# EAGLE design shield_v5 (EAGLE 6.5.0)
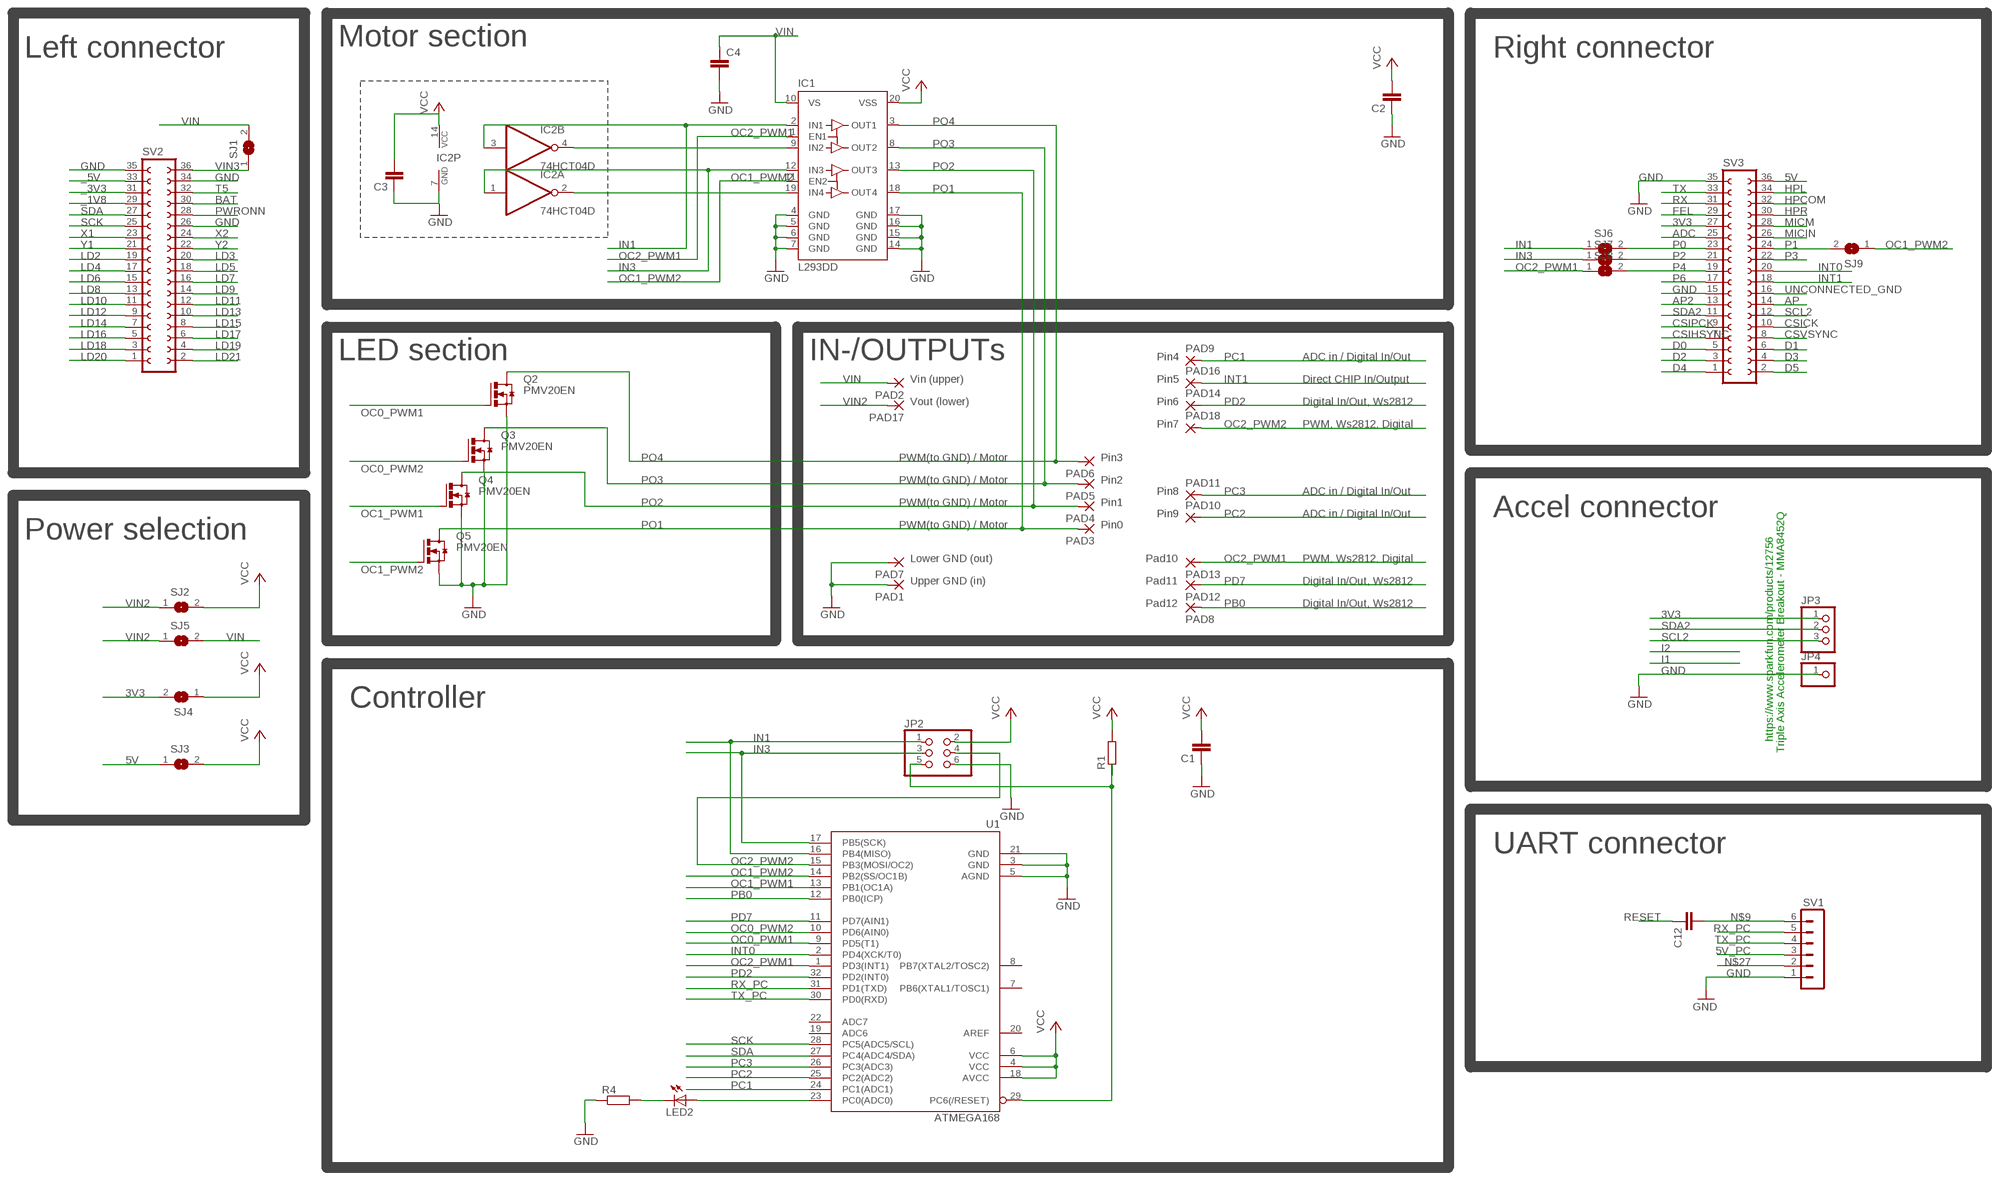
[diagram p0: schematic, sheet 1]

## Parts
C1  C-EUC0805  [C0805]
C2  C-EUC0805  [C0805]
C3  C-EUC0805  [C0805]
C4  C-EUC1210  [C1210]
C12  C-EUC1206  [C1206]
IC1  L293DD  [SO20]
IC2  74HCT04D  [SO14]
JP2  PINHD-2X3  [2X03]
JP3  PINHD-1X3  [1X03]
JP4  PINHD-1X1  [1X01]
LED2  LEDCHIP-LED0805  [CHIP-LED0805]
PAD1  3,17/1,3  [3,17/1,3]
PAD2  3,17/1,3  [3,17/1,3]
PAD3  3,17/1,3  [3,17/1,3]
PAD4  3,17/1,3  [3,17/1,3]
PAD5  3,17/1,3  [3,17/1,3]
PAD6  3,17/1,3  [3,17/1,3]
PAD7  3,17/1,3  [3,17/1,3]
PAD8  WIREPADSMD1,27-254  [SMD1,27-2,54]
PAD9  3,17/1,3  [3,17/1,3]
PAD10  3,17/1,3  [3,17/1,3]
PAD11  3,17/1,3  [3,17/1,3]
PAD12  SMD2  [SMD1,27-2,54]
PAD13  SMD2  [SMD1,27-2,54]
PAD14  3,17/1,3  [3,17/1,3]
PAD16  3,17/1,3  [3,17/1,3]
PAD17  3,17/1,3  [3,17/1,3]
PAD18  3,17/1,3  [3,17/1,3]
Q2  PMV20EN  NMOSFET_SMD_223  [SOT223]
Q3  PMV20EN  NMOSFET_SMD_223  [SOT223]
Q4  PMV20EN  NMOSFET_SMD_223  [SOT223]
Q5  PMV20EN  NMOSFET_SMD_223  [SOT223]
R1  R-EU_M1206  [M1206]
R4  R-EU_M1206  [M1206]
SJ1  SJ  [SJ]
SJ2  SJ  [SJ]
SJ3  SJ  [SJ]
SJ4  SJ  [SJ]
SJ5  SJ  [SJ]
SJ6  SJ  [SJ]
SJ7  SJ  [SJ]
SJ8  SJ  [SJ]
SJ9  SJ  [SJ]
SV1  MA06-1  [MA06-1]
SV2  FE18-2  [FE18-2]
SV3  FE18-2  [FE18-2]
U1  ATMEGA168  [TQFP32-08]

## Nets
3V3: JP3.1 SJ4.2 SV3.27
5V: SJ3.1 SV3.36
5V_PC: SV1.3
_1V8: SV2.29
_3V3: SV2.31
_5V: SV2.33
ADC: SV3.25
AP: SV3.14
AP2: SV3.13
BAT: SV2.30
CSICK: SV3.10
CSIHSYNC: SV3.7
CSIPCK: SV3.9
CSVSYNC: SV3.8
D0: SV3.5
D1: SV3.6
D2: SV3.3
D3: SV3.4
D4: SV3.1
D5: SV3.2
FEL: SV3.29
GND: C1.1 C2.1 C3.1 C4.2 IC1.4(GND) IC1.5(GND) IC1.6(GND) IC1.7(GND) IC1.14(GND) IC1.15(GND) IC1.16(GND) IC1.17(GND) IC2.7(P:GND) JP2.6 JP4.1 PAD1.1(P) PAD7.1(P) Q2.3(S) Q3.3(S) Q4.3(S) Q5.3(S) R4.1 SV1.1 SV2.26 SV2.34 SV2.35 SV3.15 SV3.35 U1.3(GND) U1.5(AGND) U1.21(GND)
HPCOM: SV3.32
HPL: SV3.34
HPR: SV3.30
IN1: IC1.2(IN1) IC2.3(B:I) JP2.1 SJ6.1 U1.16(PB4(MISO))
IN3: IC1.12(IN3) IC2.1(A:I) JP2.3 SJ7.1 U1.17(PB5(SCK))
INT0: SV3.20 U1.2(PD4(XCK/T0))
INT1: PAD16.1(P) SV3.18
LD2: SV2.19
LD3: SV2.20
LD4: SV2.17
LD5: SV2.18
LD6: SV2.15
LD7: SV2.16
LD8: SV2.13
LD9: SV2.14
LD10: SV2.11
LD11: SV2.12
LD12: SV2.9
LD13: SV2.10
LD14: SV2.7
LD15: SV2.8
LD16: SV2.5
LD17: SV2.6
LD18: SV2.3
LD19: SV2.4
LD20: SV2.1
LD21: SV2.2
MICIN: SV3.26
MICM: SV3.28
N$1: IC1.19(IN4) IC2.2(A:O)
N$9: C12.2 SV1.6
N$11: IC1.9(IN2) IC2.4(B:O)
N$23: LED2.C R4.2
N$26: LED2.A U1.23(PC0(ADC0))
N$27: SV1.2
OC0_PWM1: Q2.1(G) U1.9(PD5(T1))
OC0_PWM2: Q3.1(G) U1.10(PD6(AIN0))
OC1_PWM1: Q4.1(G) U1.13(PB1(OC1A))
OC1_PWM2: IC1.11(EN2) Q5.1(G) SJ9.1 U1.14(PB2(SS/OC1B))
OC2_PWM1: IC1.1(EN1) PAD13.1(P) SJ8.1 U1.1(PD3(INT1))
OC2_PWM2: JP2.4 PAD18.1(P) U1.15(PB3(MOSI/OC2))
P0: SJ6.2 SV3.23
P1: SJ9.2 SV3.24
P2: SJ7.2 SV3.21
P3: SV3.22
P4: SJ8.2 SV3.19
P6: SV3.17
PB0: PAD8.1(P) U1.12(PB0(ICP))
PC1: PAD9.1(P) U1.24(PC1(ADC1))
PC2: PAD10.1(P) U1.25(PC2(ADC2))
PC3: PAD11.1(P) U1.26(PC3(ADC3))
PD2: PAD14.1(P) U1.32(PD2(INT0))
PD7: PAD12.1(P) U1.11(PD7(AIN1))
PO1: IC1.18(OUT4) PAD3.1(P) Q5.2(D) Q5.4(D)
PO2: IC1.13(OUT3) PAD4.1(P) Q4.2(D) Q4.4(D)
PO3: IC1.8(OUT2) PAD5.1(P) Q3.2(D) Q3.4(D)
PO4: IC1.3(OUT1) PAD6.1(P) Q2.2(D) Q2.4(D)
PWRONN: SV2.28
RESET: C12.1 JP2.5 R1.1 U1.29(PC6(/RESET))
RX: SV3.31
RX_PC: SV1.5 U1.31(PD1(TXD))
SCK: SV2.25 U1.28(PC5(ADC5/SCL))
SCL2: JP3.3 SV3.12
SDA: SV2.27 U1.27(PC4(ADC4/SDA))
SDA2: JP3.2 SV3.11
T5: SV2.32
TX: SV3.33
TX_PC: SV1.4 U1.30(PD0(RXD))
UNCONNECTED_GND: SV3.16
VCC: C1.2 C2.2 C3.2 IC1.20(VSS) IC2.14(P:VCC) JP2.2 R1.2 SJ2.2 SJ3.2 SJ4.1 U1.4(VCC) U1.6(VCC) U1.18(AVCC)
VIN: C4.1 IC1.10(VS) PAD2.1(P) SJ1.2 SJ5.2
VIN2: PAD17.1(P) SJ2.1 SJ5.1
VIN3: SJ1.1 SV2.36
X1: SV2.23
X2: SV2.24
Y1: SV2.21
Y2: SV2.22
Unconnected: IC2.5(C:I) IC2.6(C:O) IC2.8(D:O) IC2.9(D:I) IC2.10(E:O) IC2.11(E:I) IC2.12(F:O) IC2.13(F:I) U1.7(PB6(XTAL1/TOSC1)) U1.8(PB7(XTAL2/TOSC2)) U1.19(ADC6) U1.20(AREF) U1.22(ADC7)

## Notes on the sheet
- Motor section
- Left connector | Right connector
- LED section | IN-/OUTPUTs | Pin4 | ADC in / Digital In/Out
- Vin (upper) | Pin5 | Direct CHIP In/Output
- Vout (lower) | Pin6 | Digital In/Out, Ws2812
- Pin7 | PWM, Ws2812, Digital
- PWM(to GND) / Motor | Pin3
- PWM(to GND) / Motor | Pin2
- Pin8 | ADC in / Digital In/Out
- PWM(to GND) / Motor | Pin1
- Pin9 | ADC in / Digital In/Out | Accel connector
- PWM(to GND) / Motor | Pin0
- Power selection
- Lower GND (out) | Pad10 | PWM, Ws2812, Digital
- Upper GND (in) | Pad11 | Digital In/Out, Ws2812
- Pad12 | Digital In/Out, Ws2812
- Controller
- https://www.sparkfun.com/products/12756
- Triple Axis Accelerometer Breakout - MMA8452Q
- UART connector

## Library data of the parts
C1-C4 C12 = rcl:C-EU: CAPACITOR, European symbol
IC1 = st-microelectronics:L293DD: PUSH-PULL FOUR CHANNEL DRIVER WITH DIODES Source: http://www.st.com/stonline/books/pdf/docs/1330.pdf; OC_FARNELL: unknown
IC2 = 74xx-eu:74*04: Hex INVERTER
JP2 = pinhead:PINHD-2X3: PIN HEADER
JP3 = adafruit:PINHD-1X3: PIN HEADER
JP4 = adafruit:PINHD-1X1: Pin header 1x1 for 0.1" spacing With round pins
LED2 = led:LED: LED OSRAM: - CHIPLED LG R971, LG N971, LY N971, LG Q971, LY Q971, LO R971, LY R971 LH N974, LH R974 LS Q976, LO Q976, LY Q976 LO Q996 - Hyper CHIPLED LW Q18S LB Q993, LB Q99A, LB R99A - SideLED LS A670, LO A670, LY A670, LG A670, LP A670 LB A673, LV A673, LT A673, LW A673 LH A674 LY A675 LS A676, LA A676, LO A676, LY A676, LW A676 LS A679, LY A679, LG A679 - Hyper Micro SIDELED® LS Y876, LA Y876, LO Y876, LY Y876 LT Y87S - SmartLED LW L88C, LW L88S LB L89C, LB L89S, LG L890 LS L89K, LO L89K, LY L89K LS L896, LA L896, LO L896, LY L896 - TOPLED LS T670, LO T670, LY T670, LG T670, LP T670 LSG T670, LSP T670, LSY T670, LOP T670, LYG T670 LG T671, LOG T671, LSG T671 LB T673, LV T673, LT T673, LW T673 LH T674 LS T676, LA T676, LO T676, LY T676, LB T676, LH T676, LSB T676, LW T676 LB T67C, LV T67C, LT T67C, LS T67K, LO T67K, LY T67K, LW E67C LS E67B, LA E67B, LO E67B, LY E67B, LB E67C, LV E67C, LT E67C LW T67C LS T679, LY T679, LG T679 LS T770, LO T770, LY T770, LG T770, LP T770 LB T773, LV T773, LT T773, LW T773 LH T774 LS E675, LA E675, LY E675, LS T675 LS T776, LA T776, LO T776, LY T776, LB T776 LHGB T686 LT T68C, LB T68C - Hyper Mini TOPLED® LB M676 - Mini TOPLED Santana® LG M470 LS M47K, LO M47K, LY M47K Source: http://www.osram.convergy.de LUXEON: - LUMILED® LXK2-PW12-R00, LXK2-PW12-S00, LXK2-PW14-U00, LXK2-PW14-V00 LXK2-PM12-R00, LXK2-PM12-S00, LXK2-PM14-U00 LXK2-PE12-Q00, LXK2-PE12-R00, LXK2-PE12-S00, LXK2-PE14-T00, LXK2-PE14-U00 LXK2-PB12-K00, LXK2-PB12-L00, LXK2-PB12-M00, LXK2-PB14-N00, LXK2-PB14-P00, LXK2-PB14-Q00 LXK2-PR12-L00, LXK2-PR12-M00, LXK2-PR14-Q00, LXK2-PR14-R00 LXK2-PD12-Q00, LXK2-PD12-R00, LXK2-PD12-S00 LXK2-PH12-R00, LXK2-PH12-S00 LXK2-PL12-P00, LXK2-PL12-Q00, LXK2-PL12-R00 Source: www.luxeon.com KINGBRIGHT: KA-3528ASYC Source: www.kingbright.com
PAD1-PAD7 PAD9-PAD11 PAD14 PAD16-PAD18 = wirepad:3,17/1,3: THROUGH-HOLE PAD
PAD8 = wirepad:WIREPAD: Wire PAD connect wire on PCB
PAD12 PAD13 = wirepad:SMD2: SMD PAD
Q2-Q5 = transistor-power:NMOSFET_SMD_223
R1 R4 = rcl:R-EU_: RESISTOR, European symbol
SJ1-SJ9 = jumper:SJ: SMD solder JUMPER
SV1 = con-lstb:MA06-1: PIN HEADER; OC_FARNELL: unknown; OC_NEWARK: unknown
SV2 SV3 = con-lsta:FE18-2: FEMALE HEADER; OC_FARNELL: unknown; OC_NEWARK: unknown
U1 = SparkFun-DigitalIC:ATMEGA168: Atmel 32-pin 8-bit micro, 16k flash.

## Board
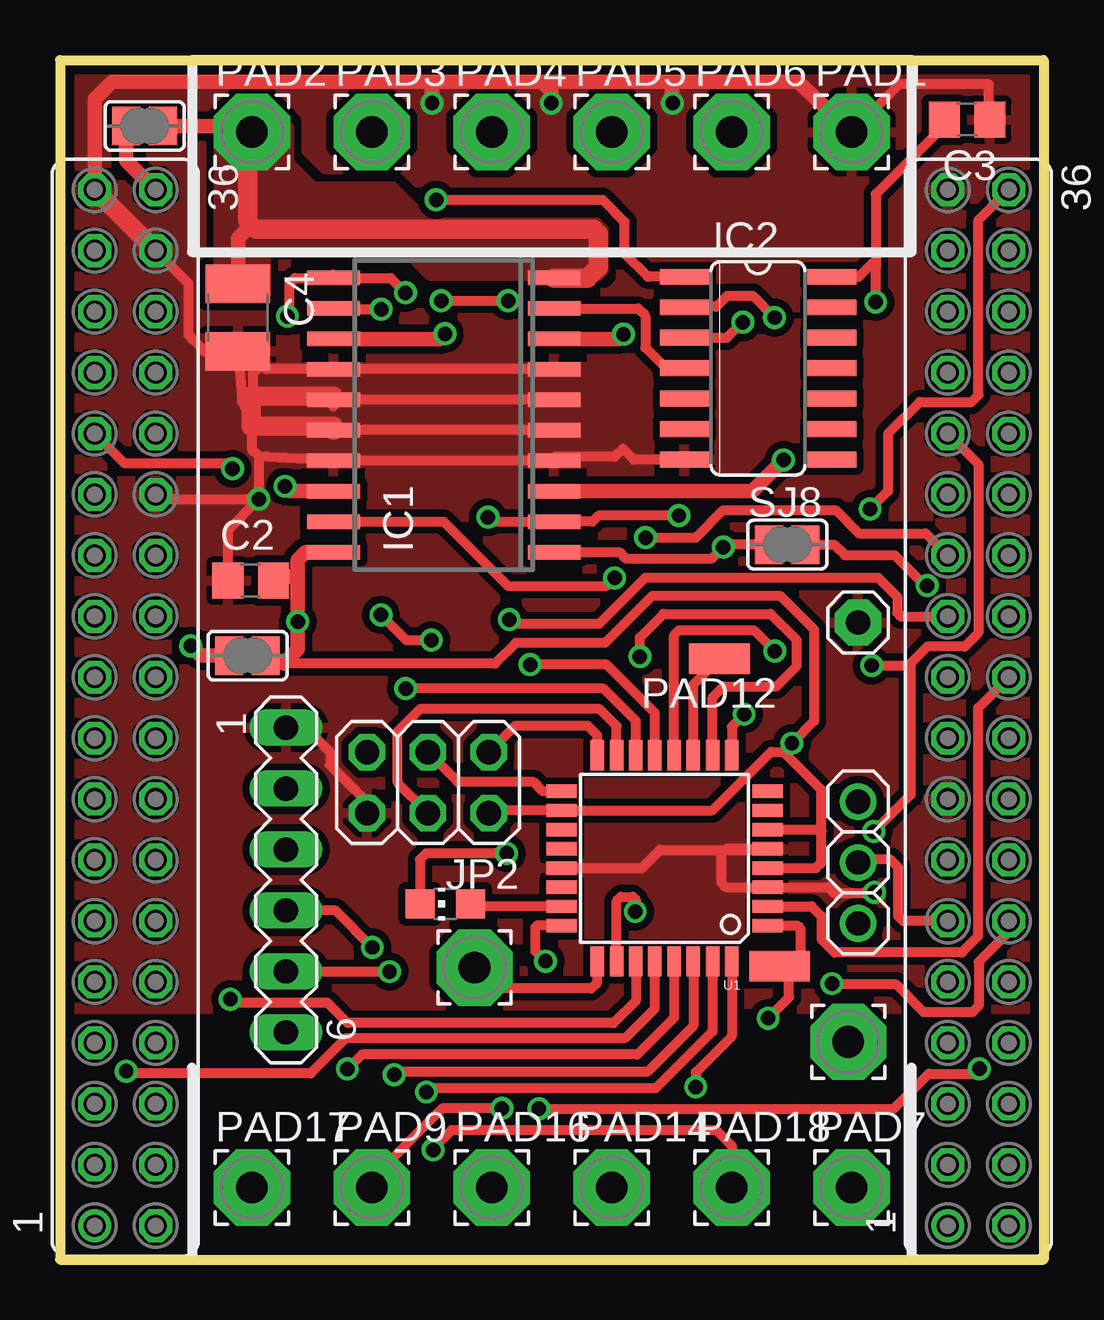
[diagram p1: board, top side]
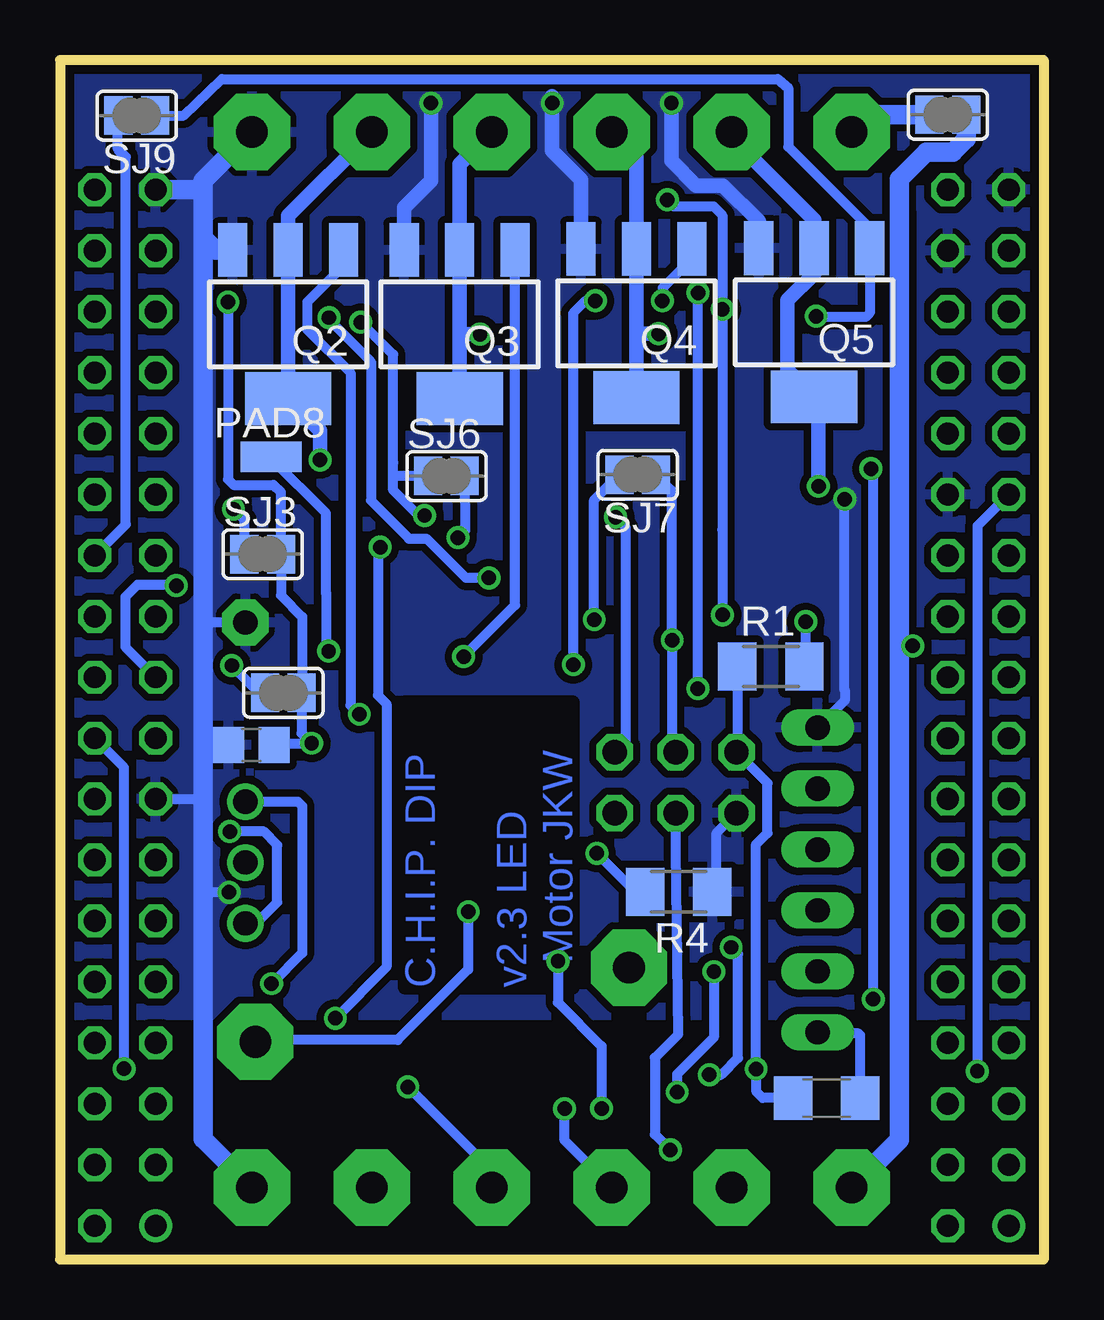
[diagram p2: board, bottom side, seen from below]

Size 41 x 50 mm. Coordinates in mm from the lower left corner, seen from the top.
Outline: 0,50 41,50 41,0 0,0 0,50
Copper layers (1*16): Top 0.0356mm / dielectric 1.5011mm / Bottom 0.0356mm
Design rules "oshpark": minimum track width 6mil, minimum drill 13mil, track to track 6mil, track to pad 6mil, pad to pad 6mil, via to via 6mil, smd to smd 6mil, copper to edge 15mil, drill to drill 6mil, minimum pad ring 7mil, minimum via ring 7mil, stop-mask expansion 3mil, vias tented up to drill 0mil, thermal gap 10mil

### Footprints (pad centres in the part's own frame; a part is rotated, then mirrored left to right if it is on the bottom)
C0805 = smd 1.3 x 1.5: 1 -0.95,0; 2 0.95,0
C1210 = smd 1.6 x 2.7: 1 -1.4,0; 2 1.4,0
C1206 = smd 1.6 x 1.8: 1 -1.4,0; 2 1.4,0
SO20 = smd 0.6 x 2.2: 1 -5.715,-4.6; 2 -4.445,-4.6; 3 -3.175,-4.6; 4 -1.905,-4.6; 5 -0.635,-4.6; 6 0.635,-4.6; 7 1.905,-4.6; 8 3.175,-4.6; 9 4.445,-4.6; 10 5.715,-4.6; 11 5.715,4.6; 12 4.445,4.6; 13 3.175,4.6; 14 1.905,4.6; 15 0.635,4.6; 16 -0.635,4.6; 17 -1.905,4.6; 18 -3.175,4.6; 19 -4.445,4.6; 20 -5.715,4.6
SO14 = smd 0.66 x 2.032: 1 -3.81,-3.073; 2 -2.54,-3.073; 3 -1.27,-3.073; 4 0,-3.073; 5 1.27,-3.073; 6 2.54,-3.073; 7 3.81,-3.073; 8 3.81,3.073; 9 2.54,3.073; 10 1.27,3.073; 11 0,3.073; 12 -1.27,3.073; 13 -2.54,3.073; 14 -3.81,3.073
2X03 = drill 1.016 octagon: 1 -2.54,-1.27; 2 -2.54,1.27; 3 0,-1.27; 4 0,1.27; 5 2.54,-1.27; 6 2.54,1.27
1X03 = drill 1.016: 1 -2.54,0; 2 0,0; 3 2.54,0
1X01 = drill 1.016 pad 1.93 octagon: 1 0,0
CHIP-LED0805 = smd 1.2 x 1.2: A 0,-1.05; C 0,1.05
3,17/1,3 = drill 1.321 pad 3.175 octagon: 1 0,0
SMD1,27-2,54 = smd 1.27 x 2.54: 1 0,0
SOT223 = smd 1.219 x 2.235: 1 -2.311,-3.099; 2 0,-3.099; 3 2.311,-3.099 | smd 3.6 x 2.2: 4 0,3.099
M1206 = smd 1.6 x 2: 1 -1.4,0; 2 1.4,0
SJ = smd 1.168 x 1.6: 1 -0.762,0; 2 0.762,0
MA06-1 = drill 1.016 long: 1 -6.35,0; 2 -3.81,0; 3 -1.27,0; 4 1.27,0; 5 3.81,0; 6 6.35,0
FE18-2 = drill 0.914: 1 -21.59,1.27 | drill 0.914 octagon: 2 -21.59,-1.27; 3 -19.05,1.27; 4 -19.05,-1.27; 5 -16.51,1.27; 6 -16.51,-1.27; 7 -13.97,1.27; 8 -13.97,-1.27; 9 -11.43,1.27; 10 -11.43,-1.27; 11 -8.89,1.27; 12 -8.89,-1.27; 13 -6.35,1.27; 14 -6.35,-1.27; 15 -3.81,1.27; 16 -3.81,-1.27; 17 -1.27,1.27; 18 -1.27,-1.27; 19 1.27,1.27; 20 1.27,-1.27; 21 3.81,1.27; 22 3.81,-1.27; 23 6.35,1.27; 24 6.35,-1.27; 25 8.89,1.27; 26 8.89,-1.27; 27 11.43,1.27; 28 11.43,-1.27; 29 13.97,1.27; 30 13.97,-1.27; 31 16.51,1.27; 32 16.51,-1.27; 33 19.05,1.27; 34 19.05,-1.27; 35 21.59,1.27; 36 21.59,-1.27
TQFP32-08 = smd 1.27 x 0.559: 1 -4.293,2.8; 2 -4.293,2; 3 -4.293,1.2; 4 -4.293,0.4; 5 -4.293,-0.4; 6 -4.293,-1.2; 7 -4.293,-2; 8 -4.293,-2.8; 17 4.293,-2.8; 18 4.293,-2; 19 4.293,-1.2; 20 4.293,-0.4; 21 4.293,0.4; 22 4.293,1.2; 23 4.293,2; 24 4.293,2.8 | smd 0.559 x 1.27: 9 -2.8,-4.293; 10 -2,-4.293; 11 -1.2,-4.293; 12 -0.4,-4.293; 13 0.4,-4.293; 14 1.2,-4.293; 15 2,-4.293; 16 2.8,-4.293; 25 2.8,4.293; 26 2,4.293; 27 1.2,4.293; 28 0.4,4.293; 29 -0.4,4.293; 30 -1.2,4.293; 31 -2,4.293; 32 -2.8,4.293

### Placement (x,y rotation side)
C1  33.02,21.45 0 bottom
C2  7.95,28.3 0 top
C3  37.81,47.52 180 top
C4  7.42,39.26 270 top
C12  9.04,6.73 0 bottom
IC1  16,35.2 90 top
IC2  29.1,37.15 270 top
JP2  15.34,19.88 180 top
JP3  33.27,16.55 90 top
JP4  33.27,26.55 0 top
LED2  16.06,14.82 90 top
PAD1  33,47 0 top
PAD2  8,47 0 top
PAD3  13,47 0 top
PAD4  18,47 0 top
PAD5  23,47 0 top
PAD6  28,47 0 top
PAD7  33,3 0 top
PAD8  32.19,33.45 270 bottom
PAD9  13,3 0 top
PAD10  17.28,12.17 0 top
PAD11  32.86,9.07 0 top
PAD12  27.49,25.05 90 top
PAD13  30,12.23 90 top
PAD14  23,3 0 top
PAD16  18,3 0 top
PAD17  8,3 0 top
PAD18  28,3 0 top
Q2  31.49,38.98 180 bottom
Q3  24.34,38.98 180 bottom
Q4  16.97,39.02 180 bottom
Q5  9.56,39.06 180 bottom
R1  11.37,24.72 0 bottom
R4  15.21,15.33 180 bottom
SJ1  3.53,47.25 0 top
SJ2  7.82,25.17 0 top
SJ3  32.55,29.4 0 bottom
SJ4  31.69,23.62 180 bottom
SJ5  3.99,47.72 180 bottom
SJ6  24.89,32.66 0 bottom
SJ7  16.92,32.71 180 bottom
SJ8  30.32,29.8 0 top
SJ9  37.8,47.68 180 bottom
SV1  9.42,15.82 270 top
SV2  2.72,23 90 top
SV3  38.28,23 90 top
U1  25.2,16.72 180 top

### Tracks (layer width: path | path; a pad name or v marks a point on that pad's centre or on a via)
3V3  (via drill 0.6)
  Top 0.406: 35.46,24.86 35.46,19.37 35.45,19.37 v33.92,17.84 | SV3.27 38.28,33.16 38.28,26.12 37.71,25.55 36.15,25.55 35.46,24.86 | v33.84,24.76 35.36,24.76 35.46,24.86
  Bottom 0.406: JP3.1 32.82,14.01 31.94,14.89 31.94,17.28 32.5,17.84 v33.92,17.84 | v33.84,24.76 32.7,23.62 SJ4.2
5V  (via drill 0.6)
  Top 0.406: v33.77,31.28 34.52,32.03 34.52,34.42 35.84,35.74 37.99,35.74 38.29,36.04 38.29,43.33 SV3.36
  Bottom 0.406: SJ3.1 33.31,30.82 v33.77,31.28
GND  (via drill 0.6)
  Top 0.152: 11.43,34.29 11.4,34.74 | 11.43,35.56 11.4,35.56
  Top 0.406: 8.34,33.48 IC1.17 IC1.4 20.61,33.46 23.12,33.46 23.46,33.8 23.92,33.34 IC2.7 | 8.34,33.48 8.3,33.48 | 8.3,33.48 8.01,33.77 8.01,34.69 | 8.01,34.69 7.96,34.74 | 7.96,36 8.04,36.08 8.04,36.91 8.41,37.28 8.6,37.1 IC1.14 IC1.7 | 7.96,35.38 7.59,35.75 C4.2 6.03,37.86 5.51,38.38 5.51,38.4 5.36,38.55 5.36,40.68 SV2.34 | 8.01,34.69 8.01,35.23 7.7,35.54 | 8.3,33.44 8.3,32.5 8.29,32.49 v8.29,31.69 | 8.3,33.44 8.3,33.48 | U1.21 24.25,16.32 25.01,17.08 29.45,17.08 U1.5 27.79,17.12 27.56,16.89 27.56,15.73 27.77,15.52 U1.3 32.01,15.52 32.25,15.28 33.92,15.28 v33.95,15.31 | 8.3,33.44 8.34,33.48 | v8.29,31.69 v8.28,31.69 | IC1.6 IC1.15 11.4,35.56 | IC1.5 IC1.16 | C3.1 38.72,47.56 38.72,48.98 34.98,48.98 PAD1.1 | SV1.1 10.24,22.17 11.26,21.15 11.26,20.62 12.8,19.08 JP2.6 | SV2.26 4.19,31.69 v8.29,31.69 | C2.1 7,30.4 v8.29,31.69 | 11.4,34.74 IC1.16 | IC1.16 | 11.4,35.56
  Top 0.61: 15.51,49.1 2.18,49.1 1.45,48.37 SV2.35 | 15.51,49.1 20.08,49.1 | 20.08,49.1 25.51,49.1 | 25.51,49.1 30.77,49.1 PAD1.1 | v25.54,48.2 25.51,48.52 25.51,49.1 | v15.51,48.2 15.51,49.1 | v20.48,48.2 20.48,48.7 20.08,49.1
  Top 0.813: SV2.35 SV2.34 | IC1.15 11.38,36 7.96,36 7.96,35.38 7.96,34.74 11.39,34.74 IC1.16
  Bottom 0.406: SV3.15 35.11,19.19 35.04,19.12 | C1.1 34.87,21.33 | SV1.1 8.29,23.3 8.29,23.73 8.3,23.74 v8.3,31.68 v8.29,31.69 | 35.05,15.41 35.04,15.42 | v33.95,15.31 34.93,15.31 35.04,15.2 | C1.1 35,21.45 35.04,21.41 | C1.1 34.9,21.45 34.92,21.43 | JP4.1 34.89,26.55 35.04,26.4 | R4.1 13.63,15.51 13.63,17.78 JP2.6
  Bottom 0.61: Q3.3 26.65,43.85 25.54,44.96 v25.54,48.2 | Q4.3 19.28,45.01 20.49,46.22 20.49,48.48 v20.48,48.2 | Q5.3 11.87,43.28 13.36,44.77 14.48,44.77 15.51,45.8 v15.51,48.2
  Bottom 0.813: PAD1.1 35.04,44.96 35.04,44.55 | 35.04,44.55 35.04,42.6 | 35.04,42.6 35.04,26.4 35.04,21.41 35.04,19.12 35.04,15.42 35.04,15.2 35.04,5.04 PAD7.1 | SV3.35 35.08,44.59 35.04,44.55 | Q2.3 34.52,42.08 35.04,42.6
  pour Top (no thermals): 7.53,37.21 22.33,37.21 23.52,37.14 23.83,37.08 24.34,36.68 24.34,33.78 24.08,33.18 8.49,33.18 7.45,34.41 5.84,34.41 5.59,34.66 5.68,38.46 6.07,38.38 7.13,38.41 7.18,38.33 8.28,38.23
  pour Top (isolate 0.305, rank 2): -0.07,10.44 40.88,10.44 41.01,10.57 41.01,50.01 38.31,50.01 0,50.01 0,10.47
  pour Bottom (isolate 0.305): 0,50 41.05,50 41.05,10.19 0.02,10.19 0.02,49.92
IN1  (via drill 0.6)
  Top 0.406: U1.16 22.4,21.85 22.01,22.24 18.97,22.24 JP2.1 | v28.46,39.07 27.81,38.42 IC2.3 | v17.84,30.94 18.02,30.75 IC1.2 22.2,30.75 22.45,31.01 v25.8,31.01
  Bottom 0.406: 27.11,32.66 27.11,33.2 27.11,37.72 v28.46,39.07 | SJ6.1 27.11,32.66 | JP2.1 17.41,21.62 17.41,30.51 v17.84,30.94 | v25.8,31.01 26.05,31.01 27.11,32.07 27.11,32.66
IN3  (via drill 0.6)
  Top 0.406: U1.17 20.12,19.52 19.74,19.9 16.59,19.9 JP2.3 | v15.68,44.17 22.62,44.17 23.54,43.25 23.54,41.92 24.5,40.96 IC2.1 | v13.39,39.61 11.44,39.61 IC1.12 | v13.38,26.87 14.43,25.82 v15.48,25.82
  Bottom 0.406: v15.68,44.17 15.41,43.9 13.76,43.9 13.39,43.53 v13.39,39.61 13.39,30.41 13.38,29.72 v13.38,26.87 | JP2.3 15.48,21.29 v15.48,25.82 15.48,32.03 SJ7.1
INT0
  Top 0.406: SV3.20 38.28,23 38.28,13.48 37.6,12.8 32.29,12.8 31.74,13.35 31.74,14.31 31.33,14.72 U1.2
INT1  (via drill 0.6)
  Top 0.406: v19.96,6.29 34.76,6.29 36.22,7.75 38.13,7.75 v38.33,7.95
  Bottom 0.406: PAD16.1 19.96,4.96 v19.96,6.29 | v38.33,7.95 38.33,20.51 SV3.18
N$1  (via drill 0.6)
  Top 0.406: IC2.2 26.05,39.71 27.36,39.71 27.82,40.17 28.88,40.17 v29.79,39.26 | IC1.19 15.99,30.75 18.67,28.08 22.79,28.08 v23.12,28.41
  Bottom 0.406: v23.12,28.41 24.08,28.41 25.72,30.05 26.45,30.05 28.04,31.64 28.04,37.42 29.79,39.17 v29.79,39.26
N$9
  Bottom 0.406: C12.2 7.64,9.35 7.71,9.42 9.37,9.42 SV1.6
N$11
  Top 0.406: IC2.4 25.26,37.15 24.4,38.01 24.4,39.34 24.09,39.65 IC1.9
N$23  (via drill 0.6)
  Top 0.406: v18.62,16.93 15.27,16.93 15.01,16.67 LED2.C
  Bottom 0.406: R4.2 17.02,15.33 v18.62,16.93
N$26
  Top 0.406: U1.23 17.21,14.72 LED2.A
OC0_PWM1  (via drill 0.6)
  Top 0.406: v28.52,22.73 28,22.21 U1.9
  Bottom 0.406: v28.52,22.73 28.89,23.1 28.89,36.96 30.69,38.76 30.69,39.91 29.18,41.42 Q2.1
OC0_PWM2  (via drill 0.6)
  Top 0.406: U1.10 27.2,23.43 27.66,23.89 29.86,23.89 30.71,24.74 30.71,25.82 29.62,26.91 25.15,26.91 24.17,25.93 v24.17,25.13
  Bottom 0.406: v24.17,25.13 22.03,27.27 Q3.1 22.06,42.05
OC1_PWM1  (via drill 0.6)
  Top 0.406: v15.89,39.96 v18.68,39.96 | U1.13 24.8,22.79 22.79,24.8 v19.6,24.8
  Bottom 0.406: v15.89,39.96 15.87,39.98 15.87,40.51 14.66,41.72 Q4.1 | v18.68,39.96 19.09,39.96 19.61,39.44 19.6,39.43 v19.6,24.8
OC1_PWM2  (via drill 0.6)
  Top 0.406: 11.37,41.06 IC1.11 | v9.48,39.32 9.58,39.42 9.58,40.7 9.79,40.91 IC1.11 | IC1.11 13.79,40.91 v14.4,40.3 | U1.14 24,22.45 22.65,23.8 v14.41,23.8
  Bottom 0.406: v14.41,23.8 v14.41,40.29 v14.4,40.3 | v9.48,39.32 9.45,39.29 7.41,39.29 7.25,39.45 Q5.1 7.25,42.2 7.25,42.99 10.64,46.38 10.64,48.83 11.08,49.2 34.26,49.2 35.85,47.68 SJ9.1
OC2_PWM1  (via drill 0.6)
  Top 0.406: U1.1 30.73,13.92 30.87,13.78 30.87,12.71 30.39,12.23 PAD13.1 30.39,11.84 30.39,10.93 v29.52,10.06 | IC1.1 23.32,29.48 23.58,29.22 27.18,29.22 v27.65,29.69 27.76,29.8 SJ8.1
  Bottom 0.406: v29.52,10.06 27.39,12.19 27.39,23.16 27.75,23.52 27.75,29.59 v27.65,29.69
OC2_PWM2  (via drill 0.6)
  Top 0.406: v15.56,4.57 15.56,4.63 16.32,5.39 27.36,5.39 28,4.75 PAD18.1 | JP2.4 14.08,19.87 14.08,22.02 15,22.94 22.49,22.94 23.2,22.23 U1.15
  Bottom 0.406: JP2.4 15.22,9.39 16.2,8.41 16.2,5.21 v15.56,4.57
P0  (via drill 0.6)
  Top 0.406: 36.98,29.38 SV3.23 36.09,30.27 33.3,30.27 32.34,31.23 27.64,31.23 26.5,30.09 v24.41,30.09
  Bottom 0.406: SJ6.2 24.11,30.39 v24.41,30.09
P1
  Bottom 0.406: SV3.24 38.26,30.64 38.26,45.96 38.59,46.29 38.59,47.65 SJ9.2
P2  (via drill 0.6)
  Top 0.406: SV3.21 35.06,26.8 34.9,26.96 34.9,27.62 34.11,28.41 24.39,28.41 22.47,26.49 18.91,26.49 v18.73,26.67
  Bottom 0.406: SJ7.2 18.73,31.66 v18.73,26.67
P4  (via drill 0.6)
  Top 0.406: SJ8.2 32.27,29.8 32.71,29.36 34.79,29.36 36.06,28.09 v36.15,28.09
  Bottom 0.406: SV3.19 38.28,25.54 38.28,27.62 37.77,28.13 36.08,28.13 v36.15,28.09
PB0  (via drill 0.6)
  Top 0.406: U1.12 25.6,26.03 25.78,26.21 28.95,26.21 v29.8,25.36
  Bottom 0.406: 29.91,27.77 29.91,25.47 v29.8,25.36 | 29.9,27.78 29.91,27.77 | 29.91,27.77 29.91,31.11 32.19,33.39 PAD8.1
PC1  (via drill 0.6)
  Top 0.406: v18.42,6.3 15.93,6.3 13,3.37 PAD9.1 | U1.24 19.88,13.92 19.81,13.85 19.81,12.86 v20.24,12.43
  Bottom 0.406: 18.47,6.35 v18.42,6.3 18.42,8.89 20.24,10.71 v20.24,12.43
PC2
  Top 0.406: PAD10.1 18.15,11.3 22.14,11.3 22.4,11.56 U1.25
PC3  (via drill 0.6)
  Top 0.406: v23.98,14.5 24,14.52 24,14.99 23.87,15.12 23.38,15.12 23.2,14.94 U1.26
  Bottom 0.406: v23.98,14.5 23.98,12.09 26.92,9.15 32.78,9.15 PAD11.1
PD2  (via drill 0.6)
  Top 0.406: U1.32 28,9.31 26.5,7.81 v26.5,7.19
  Bottom 0.406: v26.5,7.19 23,3.69 PAD14.1
PD7
  Top 0.406: U1.11 26.4,23.96 PAD12.1
PO1  (via drill 0.6)
  Top 0.406: 9.4,32.2 v9.38,32.23
  Top 0.61: IC1.18 9.59,32.02 v9.38,32.23
  Bottom 0.406: 9.38,35.78 Q5.4
  Bottom 0.61: PAD3.1 13,46.77 9.56,43.33 Q5.2 9.56,41.1 10.68,39.98 10.68,37.08 Q5.4 | v9.38,32.23 9.38,35.78
PO2  (via drill 0.6)
  Top 0.406: 16.02,38.55 v16.05,38.59
  Top 0.61: IC1.13 15.84,38.38 v16.05,38.59
  Bottom 0.61: Q4.4 16.97,38.59 | 16.97,38.59 Q4.2 16.97,45.97 PAD4.1 | v16.05,38.59 16.97,38.59
PO3  (via drill 0.6)
  Top 0.406: 23.48,38.55 v23.49,38.57
  Top 0.61: IC1.8 23.3,38.38 v23.49,38.57
  Bottom 0.406: 24.32,38.57 24.34,38.55
  Bottom 0.61: PAD5.1 24.34,45.66 Q3.2 24.34,38.55 Q3.4 | v23.49,38.57 24.32,38.57
PO4  (via drill 0.6)
  Top 0.61: v30.16,33.33 28.86,32.02 IC1.3
  Bottom 0.61: PAD6.1 31.49,43.51 Q2.2 Q2.4 30.16,34.55 v30.16,33.33
RESET  (via drill 0.6)
  Top 0.406: U1.29 25.6,10.08 24.07,8.55 12.59,8.55 v11.98,7.94
  Bottom 0.406: C12.1 11.71,6.73 11.96,6.98 11.96,7.92 v11.98,7.94 11.98,17.31 11.51,17.78 11.51,19.86 JP2.5 | 13,21.35 JP2.5 | R1.1 12.77,21.18 JP2.5
RX_PC  (via drill 0.6)
  Top 0.406: U1.31 27.2,9.51 24.83,7.14 15.44,7.14 v15.28,6.98 v15.27,6.98 | v13.74,12 SV1.5
  Bottom 0.406: v15.27,6.98 15.27,7.73 13.74,9.26 v13.74,12
SCK  (via drill 0.6)
  Top 0.406: U1.28 24.8,10.47 23.55,9.22 11.91,9.22 10.45,7.76 2.85,7.76 v2.76,7.85
  Bottom 0.406: SV2.25 2.76,30.58 v2.76,7.85
SCL2  (via drill 0.6)
  Top 0.406: SV3.12 39.55,13.65 38.3,12.4 38.3,10.57 38.04,10.31 36.01,10.31 34.86,11.46 32.22,11.46 v32.18,11.5
  Bottom 0.406: 31.86,11.82 v32.18,11.5 30.9,12.78 30.9,18.9 31.09,19.09 JP3.3
SDA  (via drill 0.6)
  Top 0.406: SV2.27 2.7,33.18 6.97,33.18 v7.19,32.96 | U1.27 24,10.78 23.08,9.86 11.99,9.86 11.15,10.7 7.25,10.7 v7.1,10.85 7.21,10.74
  Bottom 0.406: v7.1,10.85 7.1,32.87 v7.19,32.96
SDA2
  Top 0.406: SV3.11 35.14,14.11 34.94,14.31 34.94,16.34 34.61,16.67 33.39,16.67 JP3.2
TX_PC  (via drill 0.6)
  Top 0.406: 9.47,14.6 SV1.4 11.48,14.55 v13.02,13.01 | U1.30 26.4,9.75 24.48,7.83 14.06,7.83 v13.93,7.7
  Bottom 0.406: v13.93,7.7 13.43,7.7 12.73,8.4 12.73,12.72 v13.02,13.01
VCC  (via drill 0.6)
  Top 0.406: 31.12,17.92 U1.6 31.68,17.92 31.74,17.86 | v34,39.91 34,41.32 | U1.4 31.52,16.32 31.74,16.54 31.74,17.86 | 31.74,17.86 31.74,19.57 30.15,21.16 | 34,41.32 33.83,41.49 33.3,40.96 IC2.14 | 36.86,47.33 C3.2 36.86,47.27 34,44.41 34,41.32 | JP2.2 17.99,18.72 U1.18 27.2,18.72 29.64,21.16 30.15,21.16 | SJ2.2 8.91,24.84 9.32,24.84 18.14,24.84 19,25.7 22.72,25.7 24.67,27.65 30.04,27.65 31.43,26.26 31.43,22.44 v30.51,21.52 30.15,21.16
  Top 0.61: 9.32,24.84 9.91,25.43 v9.91,26.59 9.91,28.46 | IC1.20 10.23,29.48 9.91,29.16 9.91,28.46 | C2.2 9.06,28.46 9.91,28.46
  Bottom 0.406: 32.31,21.16 C1.2 | C1.2 31.94,21.4 31.82,21.52 v30.51,21.52 30.93,21.94 SJ4.1 30.9,23.65 30.9,26.79 31.79,27.68 SJ3.2 31.8,29.41 31.8,31.98 32.11,32.29 33.77,32.29 34,32.52 v34,39.91 | 31.74,21.12 C1.2 | R1.2 9.91,24.78 v9.91,26.59
VIN
  Top 0.406: 22.44,42.75 22.24,42.95 | 8.2,42.95 8,43.16 7.83,43.32 | SJ1.2 4.22,47.25
  Top 0.61: C4.1 7.42,42.58 8,43.16 | SJ1.2 7.75,47.25
  Top 0.813: 22.44,42.75 22.44,41.37 21.98,40.91 IC1.10 | 22.24,42.95 8.2,42.95 | 7.83,43.32 7.83,46.83
  Bottom 0.813: SJ5.2 7.28,47.72 PAD2.1
  pour Top (isolate 0.305, no thermals): 7.01,47.14 6.6,47.37 6.6,40.08 6.88,40.14 7.53,40.14 8.59,40.2 8.59,42.17 14.21,42.2 15.39,41.02 22.47,41.02 22.68,41.23 22.68,42.94 22.4,43.22 15.4,43.22 13.9,44.72 10.59,44.72 9.57,45.74 9.57,47.2 9.29,47.48 7.29,47.48 7.1,47.29
VIN2  (via drill 0.6)
  Top 0.61: SJ2.1 5.86,25.17 v5.45,25.58
  Bottom 0.406: 6.01,28.23 6.02,28.24 | 5.9,43.58 6.02,43.7 | v5.45,25.58 5.45,25.62 6.02,26.19
  Bottom 0.813: PAD17.1 6.02,4.98 6.02,26.19 6.02,28.24 6.02,43.7 6.02,45.03 4.89,46.16 3.78,46.16 3.23,46.71 SJ5.1
VIN3
  Top 0.61: SV2.36 2.77,45.81 SJ1.1

### Text on the board
Bottom: C.H.I.P. DIP / / v2.3 LED / Motor JKW
bStop: 5V | 0:PWM | 1:PWM | 2:PWM | 3:PWM | GND | 5V | 4:ADC | 5:C_IN | 6:A_IN | 7:NEO | GND